# Altium schematic sheet 基本外设.SchDoc
size A4
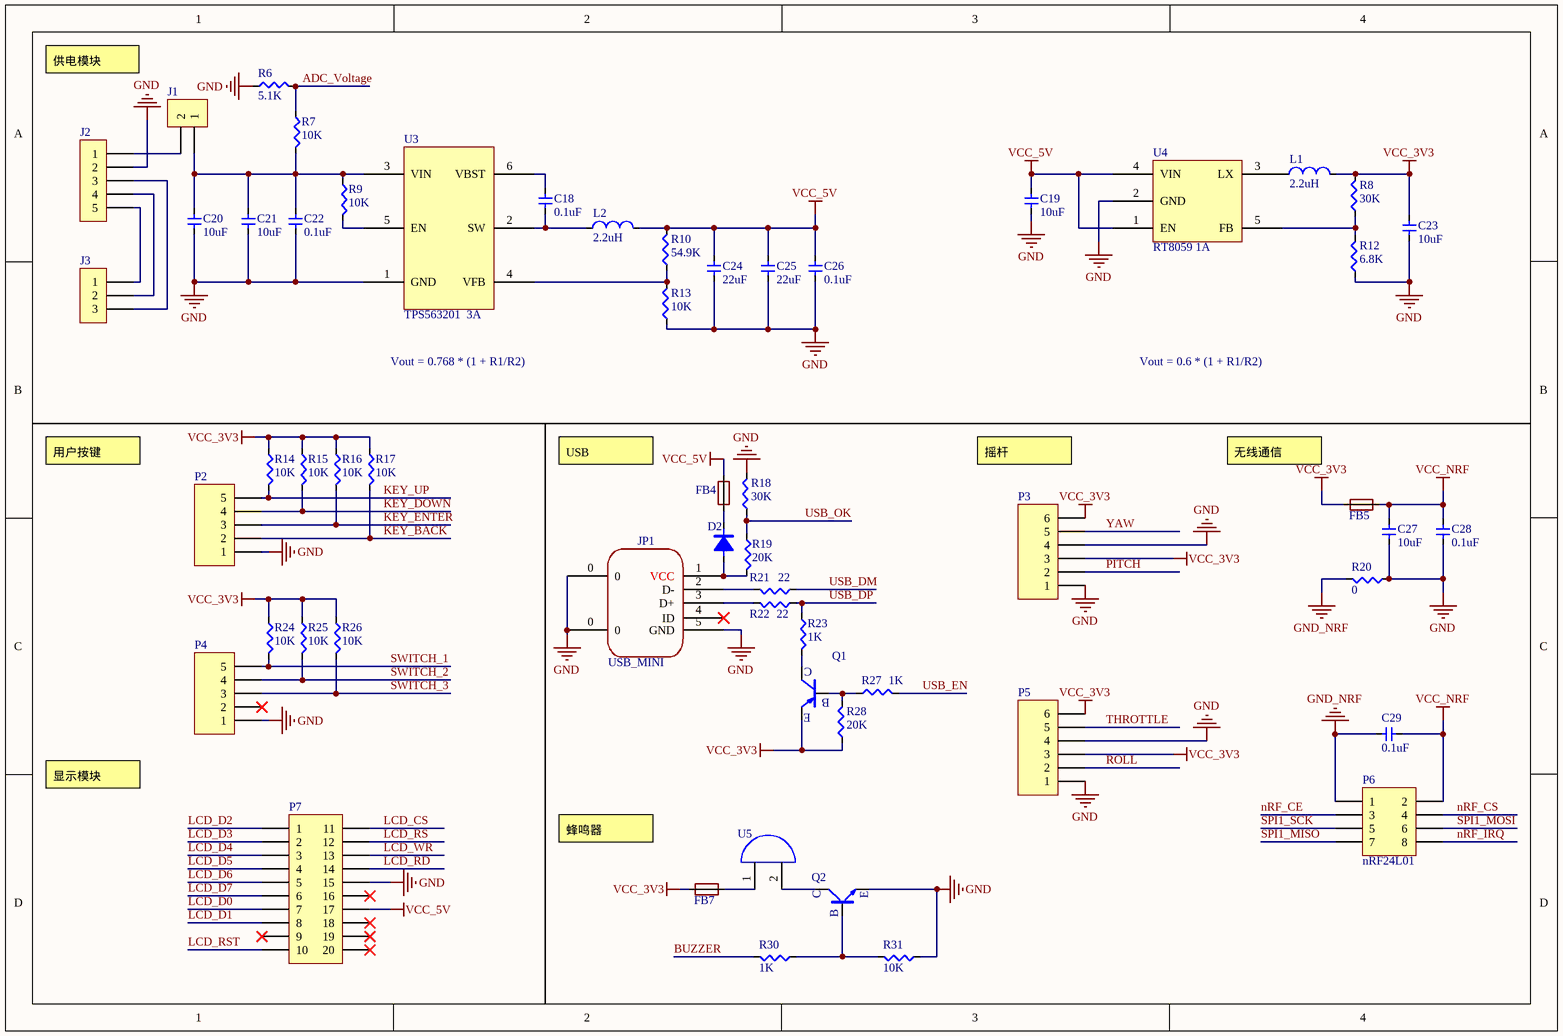
[diagram p0: 基本外设.SchDoc]

## Parts
C18  0.1uF  [C 0603_L]
C19  10uF  [C 0603_L]
C20  10uF  [C 0603_L]
C21  10uF  [C 0603_L]
C22  0.1uF  [C 0603_L]
C23  10uF  [C 0603_L]
C24  22uF  [C 0603_L]
C25  22uF  [C 0603_L]
C26  0.1uF  [C 0603_L]
C27  10uF  [C 0603_L]
C28  0.1uF  [C 0603_L]
C29  0.1uF  [C 0603_L]
D2  DX_DIODE  [SMA]  (value not drawn)
FB4  FB_BEAD  [FB 0603_L]  (value not drawn)
FB5  FB_BEAD  [FB 0603_L]  (value not drawn)
FB7  FB_BEAD  [FB 0603_L]  (value not drawn)
J1  PT_CON2  [PH2.0-WI-2P]  (value not drawn)
J2  PT_CON5  [PH2.0-WI-5P]  (value not drawn)
J3  (no value)  [PH2.0-WI-3P]
JP1  USB_MINI  [USB-MINI-5P-90度弯针]
L1  2.2uH  [L 2520]
L2  2.2uH  [L 2520]
P2  Header 5  [XH1.25-WS-5P]  (value not drawn)
P3  Header 6  [PH2.0-WS-6P]  (value not drawn)
P4  Header 6  [XH1.25-WS-5P]  (value not drawn)
P5  Header 6  [PH2.0-WS-6P]  (value not drawn)
P6  nRF24L01  [HDR2.54-2X4]
P7  Header 10X2A  [LCD_2.4_TFT]  (value not drawn)
Q1  TX_PNP  [SOT23-3L]  (value not drawn)
Q2  TX_NPN  [SOT23-3L]  (value not drawn)
R6  5.1K  [R 0603_L]
R7  10K  [R 0603_L]
R8  30K  [R 0603_L]
R9  10K  [R 0603_L]
R10  54.9K  [R 0603_L]
R12  6.8K  [R 0603_L]
R13  10K  [R 0603_L]
R14  10K  [R 0603_L]
R15  10K  [R 0603_L]
R16  10K  [R 0603_L]
R17  10K  [R 0603_L]
R18  30K  [R 0603_L]
R19  20K  [R 0603_L]
R20  0  [R 0603_L]
R21  22  [R 0603_L]
R22  22  [R 0603_L]
R23  1K  [R 0603_L]
R24  10K  [R 0603_L]
R25  10K  [R 0603_L]
R26  10K  [R 0603_L]
R27  1K  [R 0603_L]
R28  20K  [R 0603_L]
R30  1K  [R 0603_L]
R31  10K  [R 0603_L]
U3  TPS563201  3A  [SOT23-6L]
U4  RT8059 1A  [SOT23-5L]
U5  SC_BEEP  [SC_Buzzer]  (value not drawn)

## Nets
GND: C19.2 C20.2 C21.2 C22.2 C23.2 C24.2 C25.2 C26.2 C27.2 C28.2 J2.2 JP1.0 JP1.5(GND) P2.1 P3.1 P3.4 P4.1 P5.1 P5.4 P7.15 Q2.2 R6.1 R12.1 R13.1 R18.2 R20.1 R31.1 U3.1(GND) U4.2(GND)
GND_NRF: C29.1 P6.1 R20.2
VCC_3V3: C23.1 FB5.2 FB7.2 L1.2 P3.3 P3.6 P5.3 P5.6 Q1.2(E) R8.2 R14.1 R15.1 R16.1 R17.1 R24.1 R25.1 R26.1 R28.1
VCC_5V: C19.1 C24.1 C25.1 C26.1 FB4.2 L2.2 P7.17 R10.2 U4.1(EN) U4.4(VIN)
VCC_NRF: C27.1 C28.1 C29.2 FB5.1 P6.2
ADC_Voltage: R6.2 R7.1
BUZZER: R30.2
KEY_BACK: P2.2 R17.2
KEY_DOWN: P2.4 R15.2
KEY_ENTER: P2.3 R16.2
KEY_UP: P2.5 R14.2
LCD_CS: P7.11
LCD_D0: P7.7
LCD_D1: P7.8
LCD_D2: P7.1
LCD_D3: P7.2
LCD_D4: P7.3
LCD_D5: P7.4
LCD_D6: P7.5
LCD_D7: P7.6
LCD_RD: P7.14
LCD_RS: P7.12
LCD_RST: P7.10
LCD_WR: P7.13
nRF_CE: P6.3
nRF_CS: P6.4
nRF_IRQ: P6.8
PITCH: P3.2
ROLL: P5.2
SPI1_MISO: P6.7
SPI1_MOSI: P6.6
SPI1_SCK: P6.5
SWITCH_1: P4.5 R24.2
SWITCH_2: P4.4 R25.2
SWITCH_3: P4.3 R26.2
THROTTLE: P5.5
USB_DM: R21.1
USB_DP: R22.1 R23.1
USB_EN: R27.2
USB_OK: R18.1 R19.1
YAW: P3.5
NetC18_1: C18.1 U3.6(VBST)
NetC18_2: C18.2 L2.1 U3.2(SW)
NetC20_1: C20.1 C21.1 C22.1 J1.1 R7.2 R9.1 U3.3(VIN)
NetD2_1: D2.1(A) JP1.1(VCC) R19.2
NetD2_2: D2.2(K) FB4.1
NetFB7_1: FB7.1 U5.1
NetJ1_2: J1.2 J2.1
NetJ2_3: J2.3 J3.3
NetJ2_4: J2.4 J3.2
NetJ2_5: J2.5 J3.1
NetJP1_2: JP1.2(D-) R21.2
NetJP1_3: JP1.3(D+) R22.2
NetL1_1: L1.1 U4.3(LX)
NetQ1_1: Q1.1(B) R27.1 R28.2
NetQ1_3: Q1.3(C) R23.2
NetQ2_1: Q2.1 R30.1 R31.2
NetQ2_3: Q2.3 U5.2
NetR8_1: R8.1 R12.2 U4.5(FB)
NetR9_2: R9.2 U3.5(EN)
NetR10_1: R10.1 R13.2 U3.4(VFB)

Not connected (* = marked no-connect by the designer): JP1 4(ID)*; P4 2*; P7 9* 16* 18* 19* 20*

## Notes on the sheet
- 供电模块
- Vout = 0.768 * (1 + R1/R2)
- Vout = 0.6 * (1 + R1/R2)
- 用户按键
- USB
- 摇杆
- (near FB5) 无线通信
- 显示模块
- 蜂鸣器
- (in symbol TX_NPN) C; E; B

## Library data of the parts
C18-C29 = CX_CAP: 电容
D2 = DX_DIODE: 普通二极管
FB4 FB5 FB7 = FB_BEAD: 磁珠
J1 = PT_CON2: 接插件
J3 = PT_CON3
JP1 = PT_USB_MINI
L1 L2 = LX_INDUCTOR_1: 电感
P2 P4 = Header 5: Header, 5-Pin; LatestRevisionDate: 17-Jul-2002; LatestRevisionNote: Re-released for DXP Platform.; Publisher: Altium Limited
P3 P5 = Header 6: Header, 6-Pin; LatestRevisionDate: 17-Jul-2002; LatestRevisionNote: Re-released for DXP Platform.; Publisher: Altium Limited
P6 = Header 4X2: Header, 4-Pin, Dual row; LatestRevisionDate: 17-Jul-2002; LatestRevisionNote: Re-released for DXP Platform.; Publisher: Altium Limited
P7 = Header 10X2A: Header, 10-Pin, Dual row; LatestRevisionDate: 17-Jul-2002; LatestRevisionNote: Re-released for DXP Platform.; Publisher: Altium Limited
Q1 = TX_PNP: PNP三极管
Q2 = TX_NPN: NPN三极管
R6-R10 R12-R28 R30 R31 = RX_RES: 电阻
U3 = IC_DCDC_TPS563201: 稳压电源
U4 = IC_DCDC_RT8059: 稳压电源
U5 = SC_BEEP: 蜂鸣器